# EAGLE design NSP2 (EAGLE 8.3.2)
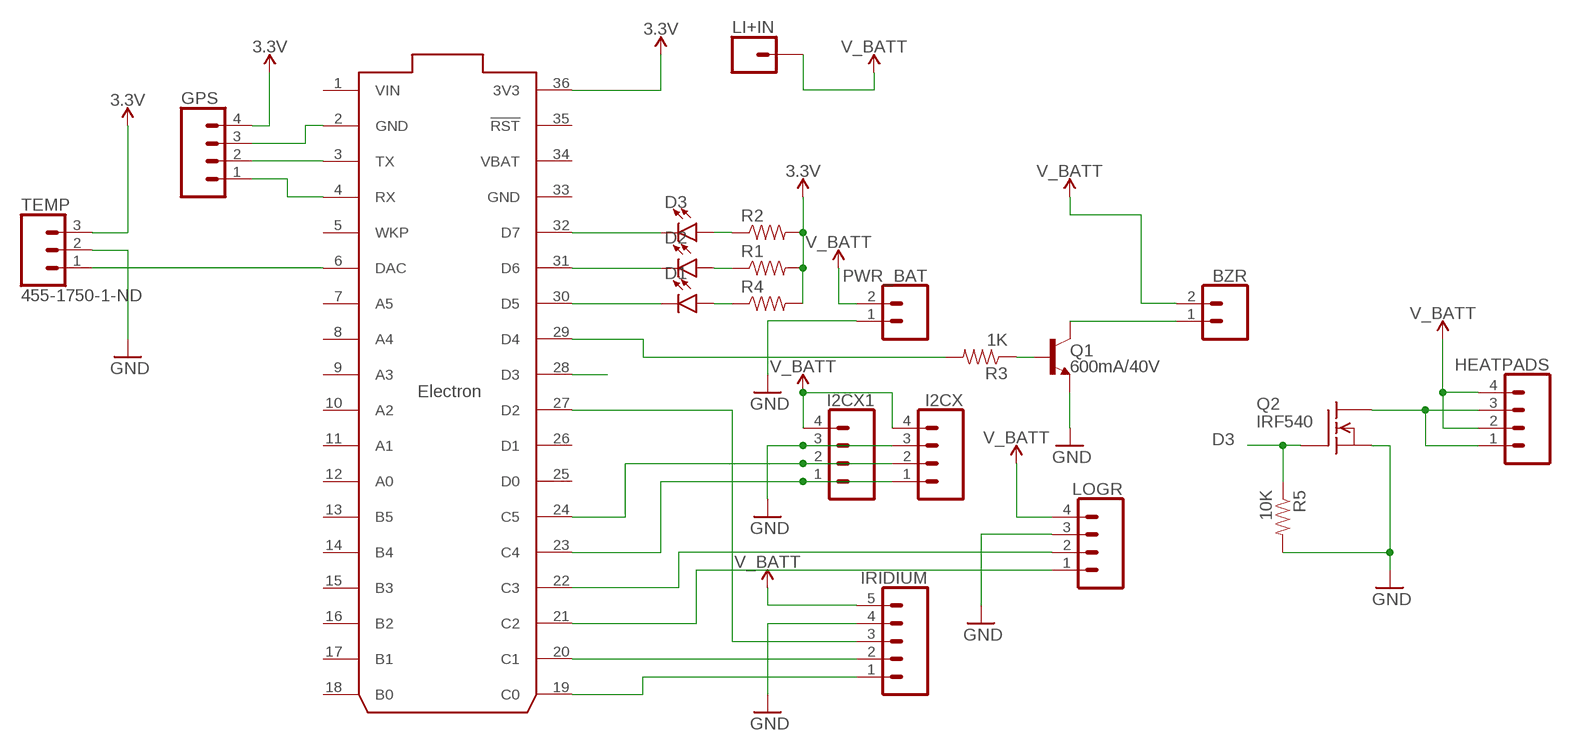
[diagram p0: schematic, sheet 1]

## Parts
BZR  CONN_02  [1X02]
D1  LED-3MM-NO_SILK  [LED_3MM-NS]
D2  LED-3MM-NO_SILK  [LED_3MM-NS]
D3  LED-3MM-NO_SILK  [LED_3MM-NS]
GPS  CONN_04  [1X04]
HEATPADS  CONN_04  [1X04]
I2CX  CONN_04  [1X04]
I2CX1  CONN_04  [1X04]
IRIDIUM  CONN_05  [1X05]
LI+IN  CONN_01  [1X01]
LOGR  CONN_04  [1X04]
PWR_BAT  CONN_02  [1X02]
Q1  600mA/40V  TRANS_NPN-P2N2222A  [TO-92]
Q2  IRF540  [TO220]
R1  RESISTORPTH-1/6W  [1/6W-RES]
R2  RESISTORPTH-1/6W  [1/6W-RES]
R3  1K  RESISTORPTH-1/6W  [1/6W-RES]
R4  RESISTORPTH-1/6W  [1/6W-RES]
R5  10K  RESISTORPTH-1/6W  [1/6W-RES]
TEMP  455-1750-1-ND  CONN_03  [1X03]
U$1  ELECTRON_WITH_HEADERS  [ELECTRON]

## Nets
3.3V: GPS.4 R1.2 R2.2 R4.2 TEMP.3 U$1.36(3V3)
D3: Q2.1(G) R5.1 U$1.28(D3)
GND: GPS.3 I2CX1.3 I2CX.3 IRIDIUM.4 LOGR.3 PWR_BAT.1 Q1.3(E) Q2.3(S) R5.2 TEMP.2 U$1.2(GND)
IRWKP: IRIDIUM.3 U$1.27(D2)
N$1: TEMP.1 U$1.6(DAC)
N$2: D3.K(C) U$1.32(D7)
N$3: D2.K(C) U$1.31(D6)
N$4: D1.K(C) U$1.30(D5)
N$5: D2.A R1.1
N$6: R3.2 U$1.29(D4)
N$7: D3.A R2.1
N$8: D1.A R4.1
N$9: BZR.1 Q1.1(C)
N$10: Q1.2(B) R3.1
N$11: HEATPADS.1 HEATPADS.3 Q2.2(D)
SCL: I2CX1.2 I2CX.2 U$1.24(C5)
SDA: I2CX1.1 I2CX.1 U$1.23(C4)
UART1_RX: GPS.1 U$1.4(RX)
UART1_TX: GPS.2 U$1.3(TX)
UART4_RX: LOGR.1 U$1.21(C2)
UART4_TX: LOGR.2 U$1.22(C3)
UART5_RX: IRIDIUM.1 U$1.19(C0)
UART5_TX: IRIDIUM.2 U$1.20(C1)
V_BATT: BZR.2 HEATPADS.2 HEATPADS.4 I2CX1.4 I2CX.4 IRIDIUM.5 LI+IN.1 LOGR.4 PWR_BAT.2
Unconnected: U$1.5(WKP) U$1.7(A5) U$1.8(A4) U$1.9(A3) U$1.10(A2) U$1.11(A1) U$1.12(A0) U$1.13(B5) U$1.14(B4) U$1.15(B3) U$1.16(B2) U$1.17(B1) U$1.18(B0) U$1.25(D0) U$1.26(D1) U$1.35(!RST)

## Power pins joined to a net without a drawn wire
GND: U$1.33(GND)
VBAT: U$1.34(VBAT)
VIN: U$1.1(VIN)

## Library data of the parts
BZR PWR_BAT = SparkFun-Connectors:CONN_02: Multi connection point. Often used as Generic Header-pin footprint for 0.1 inch spaced/style header connections On any of the 0.1 inch spaced packages, you can populate with these: Break Away Headers - Straight <https://www.sparkfun.com/products/116> (PRT-00116) Break Away Male Headers - Right Angle <https://www.sparkfun.com/products/553> (PRT-00553) Female Headers <https://www.sparkfun.com/products/115> (PRT-00115) Break Away Headers - Machine Pin <https://www.sparkfun.com/products/117> (PRT-00117) Break Away Female Headers - Swiss Machine Pin <https://www.sparkfun.com/products/743> (PRT-00743) For SCREWTERMINALS and SPRING TERMINALS visit here: Screw Terimnals on SparkFun.com <https://www.sparkfun.com/search/results?term=Screw+Terminals> (5mm/3.5mm/2.54mm spacing) This device is also useful as a general connection point to wire up your design to another part of your project. Our various solder wires solder well into these plated through hole pads. Hook-Up Wire - Assortment (Stranded, 22 AWG) <https://www.sparkfun.com/products/11375> (PRT-11375) Hook-Up Wire - Assortment (Solid Core, 22 AWG) <https://www.sparkfun.com/products/11367> (PRT-11367) View the entire wire category on our website here <https://www.sparkfun.com/categories/141> Special notes: Molex polarized connector foot print use with: PRT-08233 with associated crimp pins and housings. 2.54_SCREWTERM for use with PRT-10571. 3.5mm Screw Terminal footprints for PRT-08084 5mm Screw Terminal footprints for use with PRT-08432
D1-D3 = SparkFun-LED:LED: LED (Generic) Standard schematic elements and footprints for 5mm, 3mm, 1206, and 0603 sized LEDs. Generic LEDs with no color specified.
GPS HEATPADS I2CX I2CX1 LOGR = SparkFun-Connectors:CONN_04: Multi connection point. Often used as Generic Header-pin footprint for 0.1 inch spaced/style header connections On any of the 0.1 inch spaced packages, you can populate with these: Break Away Headers - Straight <https://www.sparkfun.com/products/116> (PRT-00116) Break Away Male Headers - Right Angle <https://www.sparkfun.com/products/553> (PRT-00553) Female Headers <https://www.sparkfun.com/products/115> (PRT-00115) Break Away Headers - Machine Pin <https://www.sparkfun.com/products/117> (PRT-00117) Break Away Female Headers - Swiss Machine Pin <https://www.sparkfun.com/products/743> (PRT-00743) For SCREWTERMINALS and SPRING TERMINALS visit here: Screw Terimnals on SparkFun.com <https://www.sparkfun.com/search/results?term=Screw+Terminals> (5mm/3.5mm/2.54mm spacing) This device is also useful as a general connection point to wire up your design to another part of your project. Our various solder wires solder well into these plated through hole pads. Hook-Up Wire - Assortment (Stranded, 22 AWG) <https://www.sparkfun.com/products/11375> (PRT-11375) Hook-Up Wire - Assortment (Solid Core, 22 AWG) <https://www.sparkfun.com/products/11367> (PRT-11367) View the entire wire category on our website here <https://www.sparkfun.com/categories/141> Special notes: Molex polarized connector foot print use with SKU : PRT-08231 with associated crimp pins and housings. 1MM SMD Version SKU: PRT-10208; PROD_ID: CONN-09696
IRIDIUM = SparkFun-Connectors:CONN_05: Multi connection point. Often used as Generic Header-pin footprint for 0.1 inch spaced/style header connections On any of the 0.1 inch spaced packages, you can populate with these: Break Away Headers - Straight <https://www.sparkfun.com/products/116> (PRT-00116) Break Away Male Headers - Right Angle <https://www.sparkfun.com/products/553> (PRT-00553) Female Headers <https://www.sparkfun.com/products/115> (PRT-00115) Break Away Headers - Machine Pin <https://www.sparkfun.com/products/117> (PRT-00117) Break Away Female Headers - Swiss Machine Pin <https://www.sparkfun.com/products/743> (PRT-00743) For SCREWTERMINALS and SPRING TERMINALS visit here: Screw Terimnals on SparkFun.com <https://www.sparkfun.com/search/results?term=Screw+Terminals> (5mm/3.5mm/2.54mm spacing) This device is also useful as a general connection point to wire up your design to another part of your project. Our various solder wires solder well into these plated through hole pads. Hook-Up Wire - Assortment (Stranded, 22 AWG) <https://www.sparkfun.com/products/11375> (PRT-11375) Hook-Up Wire - Assortment (Solid Core, 22 AWG) <https://www.sparkfun.com/products/11367> (PRT-11367) View the entire wire category on our website here <https://www.sparkfun.com/categories/141> Special notes: Molex polarized connector foot print use with SKU : PRT-08231 with associated crimp pins and housings. 1MM SMD Version SKU: PRT-10208
LI+IN = SparkFun-Connectors:CONN_01: Single connection point. Often used as Generic Header-pin footprint for 0.1 inch spaced/style header connections On any of the 0.1 inch spaced packages, you can populate with these: Break Away Headers - Straight <https://www.sparkfun.com/products/116> (PRT-00116) Break Away Male Headers - Right Angle <https://www.sparkfun.com/products/553> (PRT-00553) Female Headers <https://www.sparkfun.com/products/115> (PRT-00115) Break Away Headers - Machine Pin <https://www.sparkfun.com/products/117> (PRT-00117) Break Away Female Headers - Swiss Machine Pin <https://www.sparkfun.com/products/743> (PRT-00743) This device is also useful as a general connection point to wire up your design to another part of your project. Our various solder wires solder well into these plated through hole pads. Hook-Up Wire - Assortment (Stranded, 22 AWG) <https://www.sparkfun.com/products/11375> (PRT-11375) Hook-Up Wire - Assortment (Solid Core, 22 AWG) <https://www.sparkfun.com/products/11367> (PRT-11367) View the entire wire category on our website here <https://www.sparkfun.com/categories/141> Special notes: SMTSO-256-ET is a "flush mount" nut for a 4-40 screw. We mostly use this on specialty testbeds; it is a nice way to connect hardware to your PCB at an adjustable hieght. Also note, the SNAP packages are for using a snappable style connector. We sell a baggie of snaps and they are also used on two LilyPad designs: Snap Assortment - 30 pack (male and female) <https://www.sparkfun.com/products/11347> (DEV-11347) LilyPad Arduino SimpleSnap <https://www.sparkfun.com/products/10941> (DEV-10941) LilyPad SimpleSnap Protoboard <https://www.sparkfun.com/products/10940> (DEV-10940)
Q1 = SparkFun-DiscreteSemi:TRANS_NPN: NPN transistor Current controlled devices typically used to amplify current or used as a switch. BC547 - COM-08928 <http://www.sparkfun.com/products/8928> (TO-92 45V 100mA) (1.Collector 2.Base 3.Emitter) 2N3904 - COM-00521 <http://www.sparkfun.com/products/521> (TO-92 40V 200mA) (1.Emitter 2.Base 3.Collector) P2N2222A - COM-12852 <http://www.sparkfun.com/products/12852> (TO-92 40V 600mA) (1.Collector 2.Base 3.Emitter); PROD_ID: TRANS-09536
Q2 = transistor-fet:IRF540: N-Channel Enhancement MOSFET (HEXFET); 100V; 28A; 0,077Ohm
R1-R5 = SparkFun-Passives:RESISTOR: Resistor Basic schematic elements and footprints for 0603, 1206, and PTH resistors.
TEMP = SparkFun-Connectors:CONN_03: Multi connection point. Often used as Generic Header-pin footprint for 0.1 inch spaced/style header connections On any of the 0.1 inch spaced packages, you can populate with these: Break Away Headers - Straight <https://www.sparkfun.com/products/116> (PRT-00116) Break Away Male Headers - Right Angle <https://www.sparkfun.com/products/553> (PRT-00553) Female Headers <https://www.sparkfun.com/products/115> (PRT-00115) Break Away Headers - Machine Pin <https://www.sparkfun.com/products/117> (PRT-00117) Break Away Female Headers - Swiss Machine Pin <https://www.sparkfun.com/products/743> (PRT-00743) Stackable Header - 3 Pin (Female, 0.1") <https://www.sparkfun.com/products/13875> (PRT-13875) For SCREWTERMINALS and SPRING TERMINALS visit here: Screw Terimnals on SparkFun.com <https://www.sparkfun.com/search/results?term=Screw+Terminals> (5mm/3.5mm/2.54mm spacing) This device is also useful as a general connection point to wire up your design to another part of your project. Our various solder wires solder well into these plated through hole pads. Hook-Up Wire - Assortment (Stranded, 22 AWG) <https://www.sparkfun.com/products/11375> (PRT-11375) Hook-Up Wire - Assortment (Solid Core, 22 AWG) <https://www.sparkfun.com/products/11367> (PRT-11367) View the entire wire category on our website here <https://www.sparkfun.com/categories/141> Special notes: Molex polarized connector foot print use with SKU : PRT-08232 with associated crimp pins and housings.; PROD_ID: XXX-00000
U$1 = Particle-Devices:ELECTRON: Particle Electron footprint

## Board
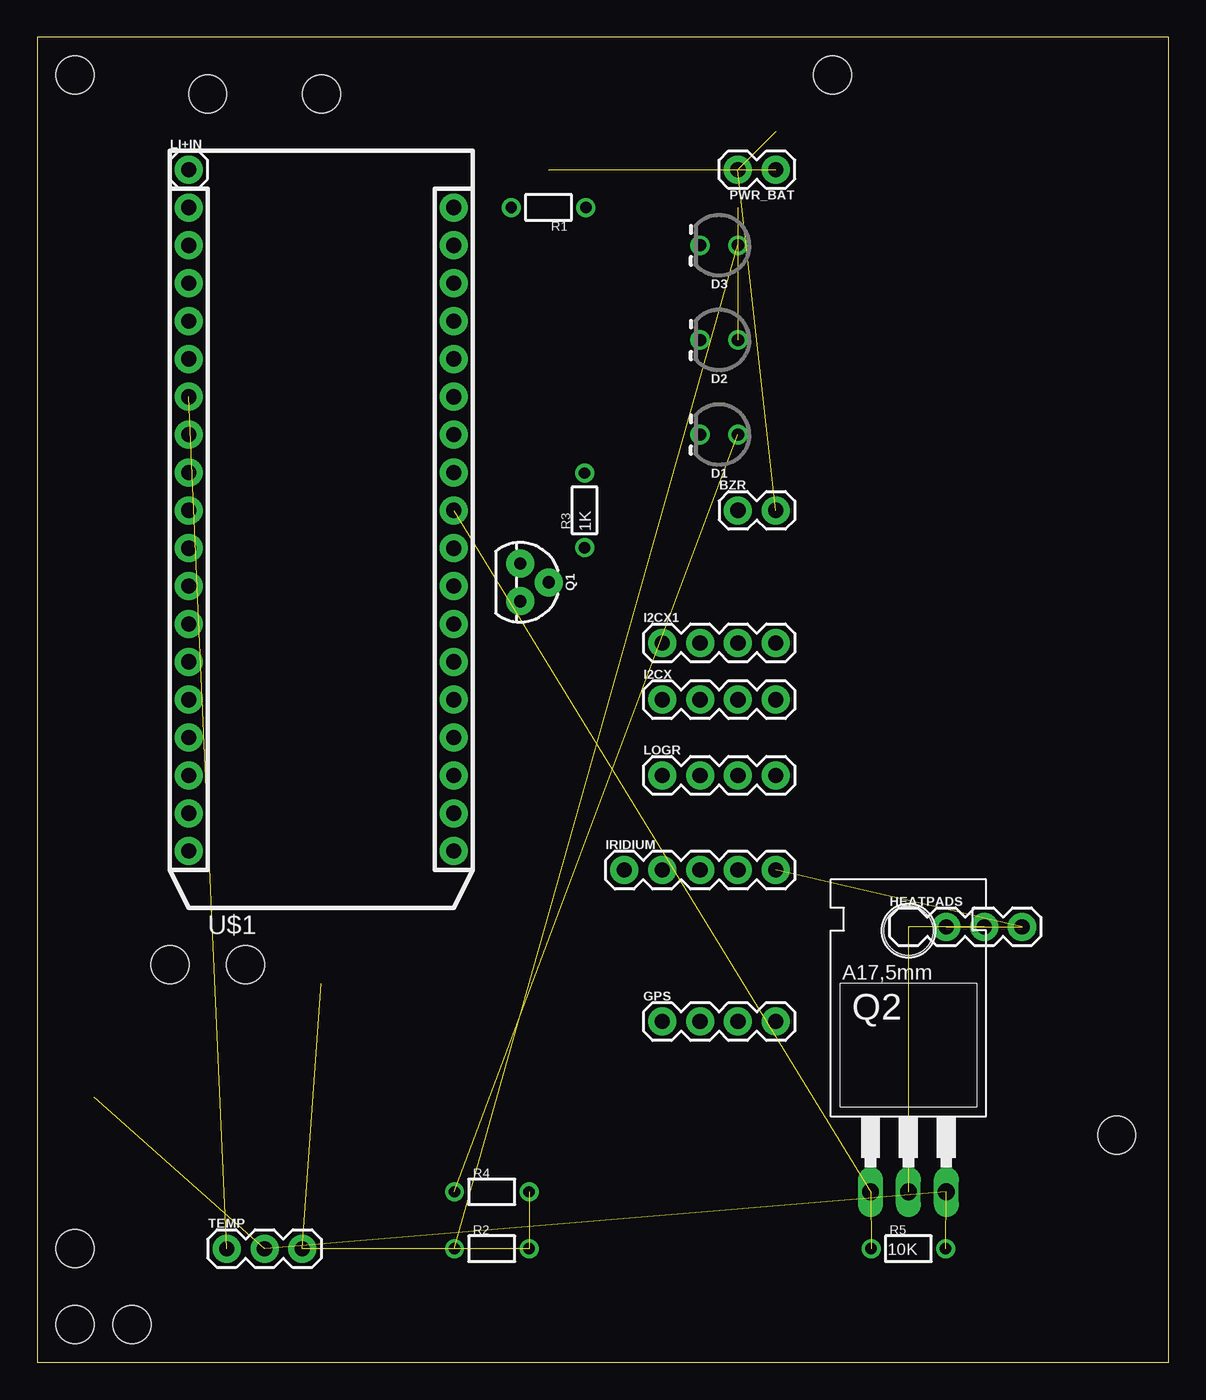
[diagram p1: board, top side]
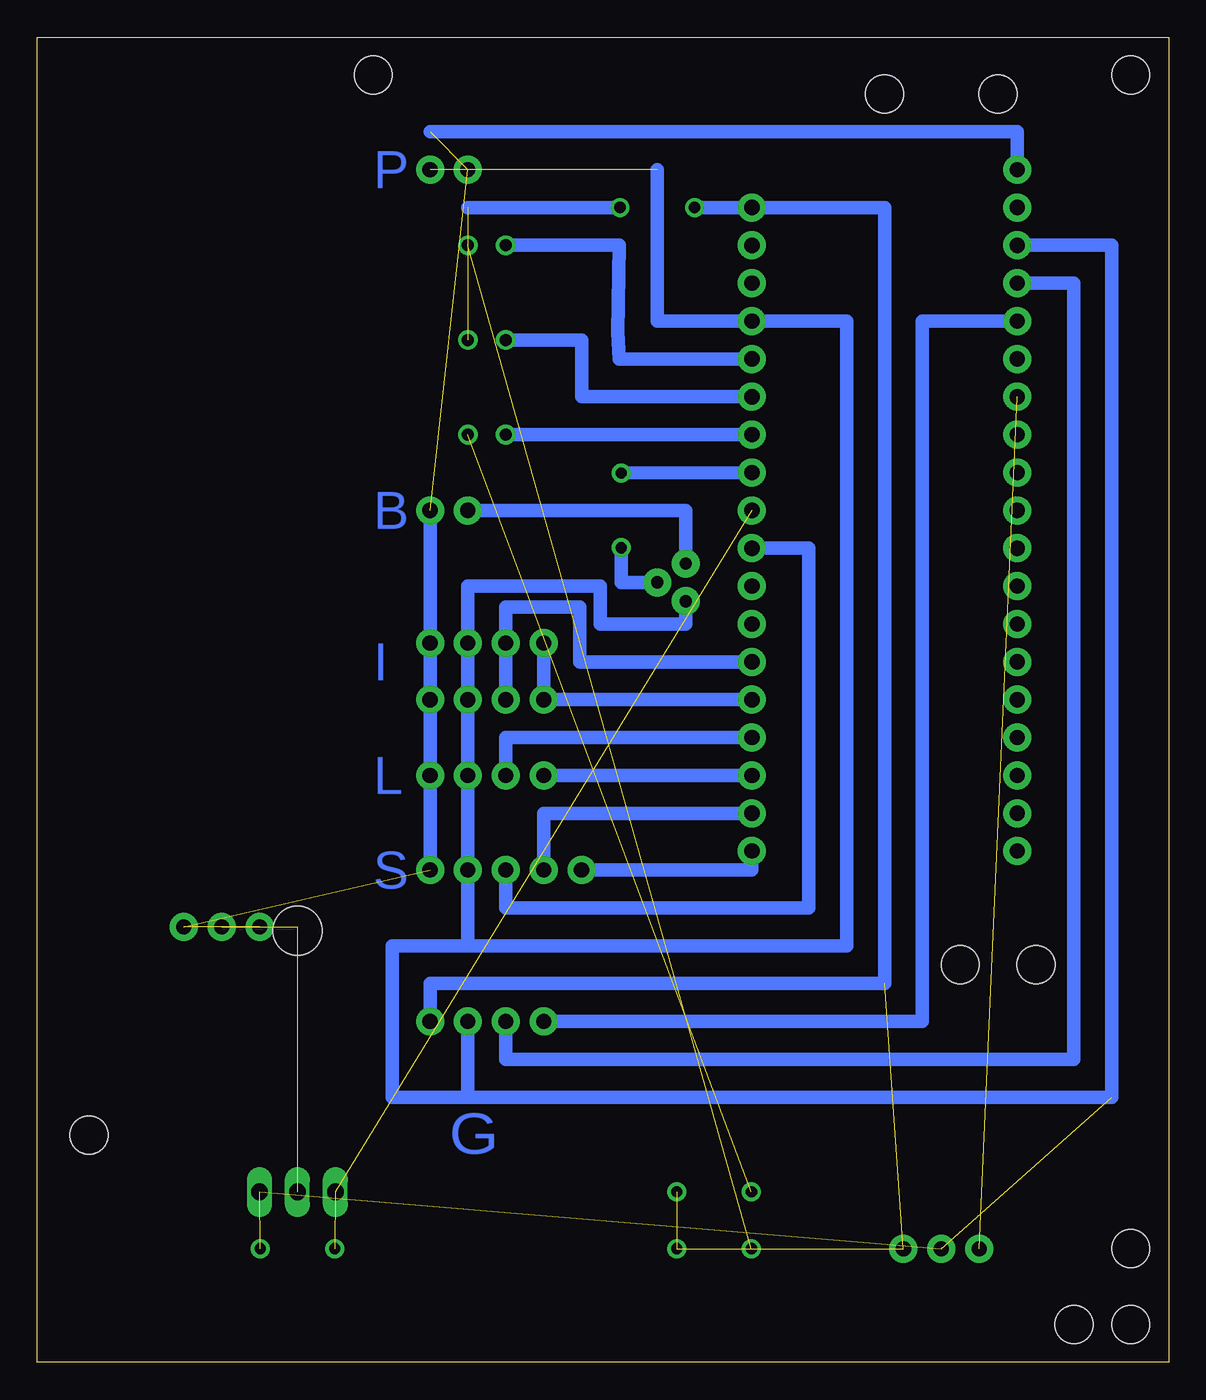
[diagram p2: board, bottom side, seen from below]

Size 75.87 x 88.89 mm. Coordinates in mm from the lower left corner, seen from the top.
Outline: 0,0 75.87,0 75.87,88.89 0,88.89 0,0
Copper layers (1*16): Top 0.035mm / dielectric 1.5mm / Bottom 0.035mm
Design rules "default": minimum track width 6mil, minimum drill 0.35mm, track to track 6mil, track to pad 6mil, pad to pad 6mil, via to via 6mil, smd to smd 6mil, copper to edge 40mil, drill to drill 6mil, minimum pad ring 10mil, minimum via ring 8mil, stop-mask expansion 4mil, vias tented up to drill 0mil, thermal gap 10mil
Holes 2.54 mm at 2.54,2.54 72.39,15.24 53.34,86.36 2.54,86.36 11.43,85.09 19.05,85.09 8.89,26.67 13.97,26.67 6.35,2.54 2.54,7.62

### Footprints (pad centres in the part's own frame; a part is rotated, then mirrored left to right if it is on the bottom)
1X02 = drill 1.016 pad 1.88: 1 0,0; 2 2.54,0
LED_3MM-NS = drill 0.813: A -1.27,0; K 1.27,0
1X04 = drill 1.016 pad 1.88: 1 0,0; 2 2.54,0; 3 5.08,0; 4 7.62,0
1X05 = drill 1.016 pad 1.88: 1 0,0; 2 2.54,0; 3 5.08,0; 4 7.62,0; 5 10.16,0
1X01 = drill 1.016 pad 1.88: 1 0,0
TO-92 = drill 0.813 pad 1.88: 1 -1.27,0; 2 0,1.905; 3 1.27,0
TO220 = drill 1.118 long: 1 -2.54,-6.35; 2 0,-6.35; 3 2.54,-6.35 | hole 3.302: 0,11.176
1/6W-RES = drill 0.762: 1 -2.5,0; 2 2.5,0
1X03 = drill 1.016 pad 1.88: 1 0,0; 2 2.54,0; 3 5.08,0
ELECTRON = drill 1.016 pad 1.88: 1 1.27,46.99; 2 1.27,44.45; 3 1.27,41.91; 4 1.27,39.37; 5 1.27,36.83; 6 1.27,34.29; 7 1.27,31.75; 8 1.27,29.21; 9 1.27,26.67; 10 1.27,24.13; 11 1.27,21.59; 12 1.27,19.05; 13 1.27,16.51; 14 1.27,13.97; 15 1.27,11.43; 16 1.27,8.89; 17 1.27,6.35; 18 1.27,3.81; 19 19.05,3.81; 20 19.05,6.35; 21 19.05,8.89; 22 19.05,11.43; 23 19.05,13.97; 24 19.05,16.51; 25 19.05,19.05; 26 19.05,21.59; 27 19.05,24.13; 28 19.05,26.67; 29 19.05,29.21; 30 19.05,31.75; 31 19.05,34.29; 32 19.05,36.83; 33 19.05,39.37; 34 19.05,41.91; 35 19.05,44.45; 36 19.05,46.99

### Placement (x,y rotation side)
BZR  46.99,57.15 0 top
D1  45.72,62.23 180 top
D2  45.72,68.58 180 top
D3  45.72,74.93 180 top
GPS  41.91,22.86 0 top
HEATPADS  58.42,29.21 0 top
I2CX  41.91,44.45 0 top
I2CX1  41.91,48.26 0 top
IRIDIUM  39.37,33.02 0 top
LI+IN  10.16,80.01 0 top
LOGR  41.91,39.37 0 top
PWR_BAT  49.53,80.01 180 top
Q1  32.38,52.32 270 top
Q2  58.42,17.78 0 top
R1  34.29,77.47 180 top
R2  30.48,7.62 0 top
R3  36.7,57.15 90 top
R4  30.48,11.43 0 top
R5  58.42,7.62 0 top
TEMP  12.7,7.62 0 top
U$1  8.89,30.48 0 top

### Tracks (layer width: path | path; a pad name or v marks a point on that pad's centre or on a via)
3.3V  (3 unrouted)
  Bottom 0.889: GPS.4 49.53,25.4 19.05,25.4 19.05,77.47 U$1.36 R1.2
D3  (2 unrouted)
GND  (4 unrouted)
  Bottom 0.889: 34.29,80.01 34.29,69.85 U$1.33 21.59,69.85 21.59,27.94 46.99,27.94 | 46.99,27.94 IRIDIUM.4 LOGR.3 I2CX.3 I2CX1.3 46.99,52.07 38.1,52.07 38.1,49.53 32.38,49.53 Q1.3 | 46.99,17.78 GPS.3 | 46.99,17.78 3.81,17.78 3.81,74.93 U$1.2 | 46.99,27.94 52.07,27.94 52.07,17.78 46.99,17.78
IRWKP
  Bottom 0.889: U$1.27 24.13,54.61 24.13,30.48 44.45,30.48 IRIDIUM.3
N$1  (1 unrouted)
N$2
  Bottom 0.889: D3.K 36.83,74.93 36.96,69.09 36.83,67.31 U$1.32
N$3
  Bottom 0.889: D2.K 39.37,68.58 39.37,64.77 U$1.31
N$4
  Bottom 0.889: U$1.30 D1.K
N$5  (1 unrouted)
  Bottom 0.889: 46.99,77.47 R1.1
N$6
  Bottom 0.889: R3.2 U$1.29
N$7  (1 unrouted)
N$8  (1 unrouted)
N$9
  Bottom 0.889: BZR.1 32.38,57.15 Q1.1
N$10
  Bottom 0.889: Q1.2 36.7,52.32 R3.1
N$11  (2 unrouted)
SCL
  Bottom 0.889: U$1.24 39.5,46.99 39.5,50.67 44.45,50.67 I2CX1.2 I2CX.2
SDA
  Bottom 0.889: I2CX1.1 I2CX.1 U$1.23
UART1_RX
  Bottom 0.889: GPS.1 16.51,22.86 16.51,69.85 U$1.4
UART1_TX
  Bottom 0.889: GPS.2 44.45,20.32 6.35,20.32 6.35,72.39 U$1.3
UART4_RX
  Bottom 0.889: LOGR.1 U$1.21
UART4_TX
  Bottom 0.889: LOGR.2 44.45,41.91 U$1.22
UART5_RX
  Bottom 0.889: IRIDIUM.1 27.94,33.02 U$1.19
UART5_TX
  Bottom 0.889: IRIDIUM.2 41.91,36.83 U$1.20
V_BATT  (4 unrouted)
  Bottom 0.889: IRIDIUM.5 LOGR.4 I2CX.4 I2CX1.4 BZR.2 | 49.53,82.55 10.16,82.55 LI+IN.1

### Text on the board
Bottom: P | B | I | L | S | G